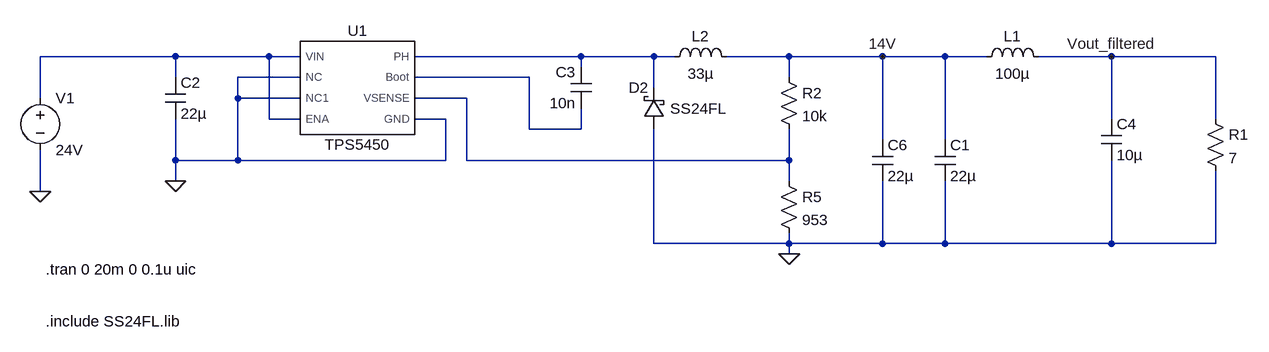
[diagram p0: schematic buck_24v_14v.asc]
buck_24v_14v.asc, the LTspice schematic file:
Version 4
SHEET 1 880 952
WIRE -1248 128 -1456 128
WIRE -1104 128 -1248 128
WIRE -1056 128 -1104 128
WIRE -624 128 -880 128
WIRE -512 128 -624 128
WIRE -480 128 -512 128
WIRE -304 128 -400 128
WIRE -160 128 -304 128
WIRE -64 128 -160 128
WIRE 0 128 -64 128
WIRE 192 128 80 128
WIRE 352 128 192 128
WIRE -624 144 -624 128
WIRE -1248 160 -1248 128
WIRE -1056 160 -1152 160
WIRE -704 160 -880 160
WIRE -304 160 -304 128
WIRE -512 176 -512 128
WIRE -1456 192 -1456 128
WIRE -1152 192 -1152 160
WIRE -1056 192 -1152 192
WIRE -800 192 -880 192
WIRE -1104 224 -1104 128
WIRE -1056 224 -1104 224
WIRE -832 224 -880 224
WIRE 192 224 192 128
WIRE 352 224 352 128
WIRE -704 240 -704 160
WIRE -624 240 -624 208
WIRE -624 240 -704 240
WIRE -160 256 -160 128
WIRE -64 256 -64 128
WIRE -1248 288 -1248 224
WIRE -1152 288 -1152 192
WIRE -1152 288 -1248 288
WIRE -832 288 -832 224
WIRE -832 288 -1152 288
WIRE -800 288 -800 192
WIRE -304 288 -304 240
WIRE -304 288 -800 288
WIRE -1248 320 -1248 288
WIRE -304 320 -304 288
WIRE -1456 336 -1456 272
WIRE -512 416 -512 240
WIRE -304 416 -304 400
WIRE -304 416 -512 416
WIRE -160 416 -160 320
WIRE -160 416 -304 416
WIRE -64 416 -64 320
WIRE -64 416 -160 416
WIRE 192 416 192 288
WIRE 192 416 -64 416
WIRE 352 416 352 304
WIRE 352 416 192 416
WIRE -304 432 -304 416
FLAG -1456 336 0
FLAG -1248 320 0
FLAG -304 432 0
FLAG -160 128 14V
FLAG 192 128 Vout_filtered
SYMBOL voltage -1456 176 R0
WINDOW 123 0 0 Left 0
WINDOW 39 0 0 Left 0
SYMATTR InstName V1
SYMATTR Value 24V
SYMBOL cap -1264 160 R0
SYMATTR InstName C2
SYMATTR Value 22µ
SYMATTR SpiceLine Rser=10m
SYMBOL cap -608 208 R180
WINDOW 0 24 56 Left 2
WINDOW 3 24 8 Left 2
SYMATTR InstName C3
SYMATTR Value 10n
SYMATTR SpiceLine Rser=78m
SYMBOL ind -496 144 R270
WINDOW 0 32 56 VTop 2
WINDOW 3 5 56 VBottom 2
SYMATTR InstName L2
SYMATTR Value 33µ
SYMATTR SpiceLine Rser=144m
SYMBOL res -320 144 R0
SYMATTR InstName R2
SYMATTR Value 10k
SYMBOL res -320 304 R0
SYMATTR InstName R5
SYMATTR Value 953
SYMBOL cap -176 256 R0
SYMATTR InstName C6
SYMATTR Value 22µ
SYMATTR SpiceLine Rser=400m
SYMBOL schottky -496 240 R180
WINDOW 0 24 64 Left 2
WINDOW 3 -96 32 Left 2
SYMATTR InstName D2
SYMATTR Value SS24FL
SYMATTR Description Diode
SYMATTR Type diode
SYMBOL TPS5450 -976 176 R0
SYMATTR InstName U1
SYMBOL cap -80 256 R0
SYMATTR InstName C1
SYMATTR Value 22µ
SYMATTR SpiceLine Rser=400m
SYMBOL ind -16 144 R270
WINDOW 0 32 56 VTop 2
WINDOW 3 5 56 VBottom 2
SYMATTR InstName L1
SYMATTR Value 100µ
SYMBOL cap 176 224 R0
SYMATTR InstName C4
SYMATTR Value 10µ
SYMBOL res 336 208 R0
SYMATTR InstName R1
SYMATTR Value 7
TEXT -1448 456 Left 2 !.tran 0 20m 0 0.1u uic
TEXT -1448 536 Left 2 !.include SS24FL.lib

The netlist it stands for:
* buck_24v_14v.asc
V1 N001 0 24V
C2 N001 0 22µ Rser=10m
C3 N003 N002 10n Rser=78m
L2 N002 14V 33µ Rser=144m
R2 14V N004 10k
R5 N004 0 953
C6 14V 0 22µ Rser=400m
D2 0 N002 SS24FL
XU1 N001 0 0 N001 N002 N003 N004 0 TPS5450  ; pins VIN NC NC1 ENA PH Boot VSENSE GND
C1 14V 0 22µ Rser=400m
L1 14V Vout_filtered 100µ
C4 Vout_filtered 0 10µ
R1 Vout_filtered 0 7
.model D D
.lib standard.dio
.tran 0 20m 0 0.1u uic
.include SS24FL.lib
.lib TPS5450.LIB
.backanno
.end